# EAGLE design HM10 Breakout (EAGLE 9.6.2)
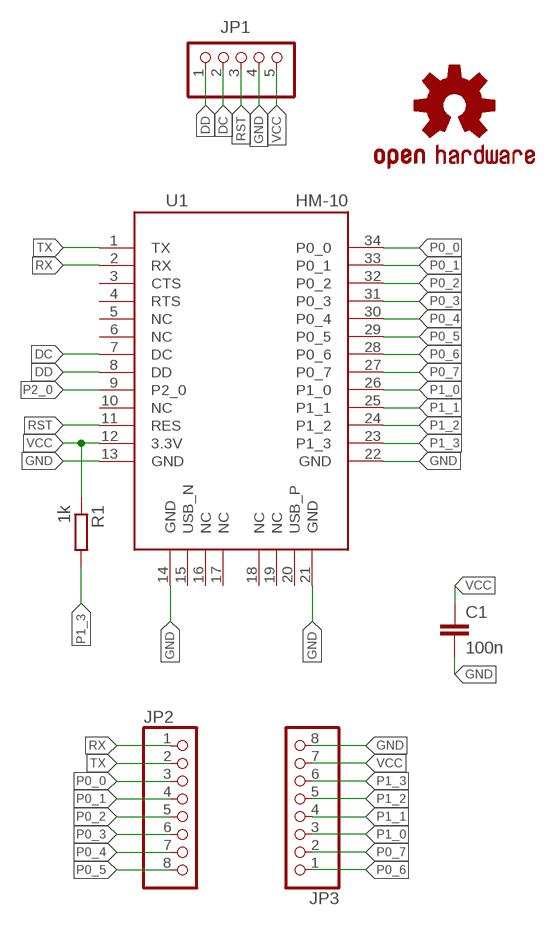
[diagram p0: schematic, sheet 1]

## Parts
C1  100n  C-EU1206  [1206]
JP1  PINHD-1X5  [1X05]
JP2  PINHD-1X8  [1X08]
JP3  PINHD-1X8  [1X08]
LOGO1  OSHW-LOGOM  [OSHW-LOGO-M]
R1  1k  R-EU_R1206  [R1206]
U1  HM-10  [HM-10]

## Nets
DC: JP1.2 U1.7(DC)
DD: JP1.1 U1.8(DD)
GND: C1.2 JP1.4 JP3.8 U1.13(GND) U1.14(GND) U1.21(GND) U1.22(GND)
P0_0: JP2.3 U1.34(P0_0)
P0_1: JP2.4 U1.33(P0_1)
P0_2: JP2.5 U1.32(P0_2)
P0_3: JP2.6 U1.31(P0_3)
P0_4: JP2.7 U1.30(P0_4)
P0_5: JP2.8 U1.29(P0_5)
P0_6: JP3.1 U1.28(P0_6)
P0_7: JP3.2 U1.27(P0_7)
P1_0: JP3.3 U1.26(P1_0)
P1_1: JP3.4 U1.25(P1_1)
P1_2: JP3.5 U1.24(P1_2)
P1_3: JP3.6 R1.2 U1.23(P1_3)
P2_0: U1.9(P2_0)
RST: JP1.3 U1.11(RES)
RX: JP2.1 U1.2(RX)
TX: JP2.2 U1.1(TX)
VCC: C1.1 JP1.5 JP3.7 R1.1 U1.12(3.3V)
Unconnected: U1.3(CTS) U1.4(RTS) U1.5(NC) U1.6(NC) U1.10(NC) U1.15(USB_N) U1.16(NC) U1.17(NC) U1.18(NC) U1.19(NC) U1.20(USB_P)

## Library data of the parts
C1 = Master 2016:C-EU: CAPACITOR, European symbol
JP1 = pinhead:PINHD-1X5: PIN HEADER
JP2 JP3 = pinhead:PINHD-1X8: PIN HEADER
LOGO1 = Master 2016:OSHW-LOGO: Open Source Hardware Logo This logo indicates the piece of hardware it is found on incorporates a OSHW license and/or adheres to the definition of open source hardware found here: http://freedomdefined.org/OSHW
R1 = rcl:R-EU_: RESISTOR, European symbol; SPICEPREFIX: R
U1 = SMD Stamp Modules:HM-10

## Board
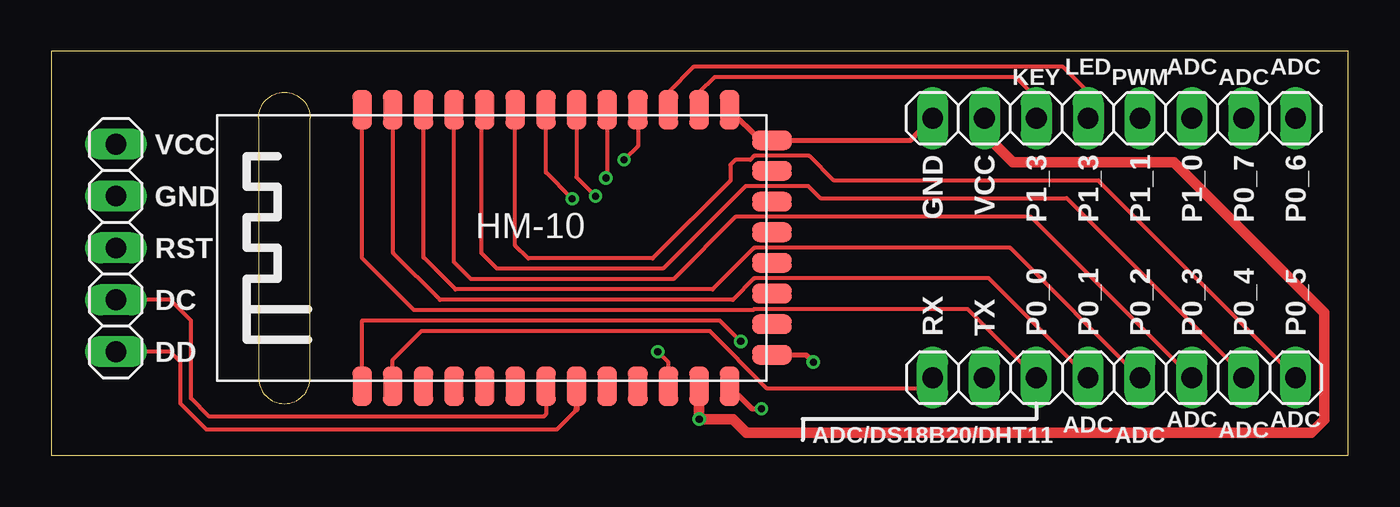
[diagram p1: board, top side]
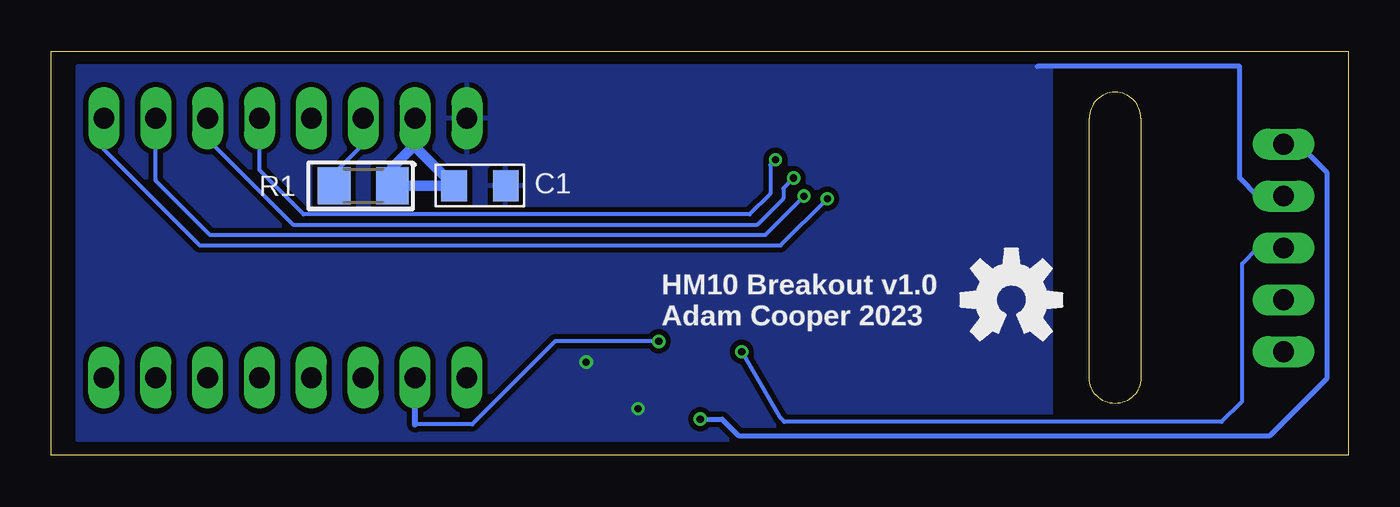
[diagram p2: board, bottom side, seen from below]

Size 63.55 x 19.8 mm. Coordinates in mm from the lower left corner, seen from the top.
Outline: 0,0 63.55,0 63.55,19.8 0,19.8 0,0
Copper layers (1*16): Top 0.035mm / dielectric 1.5mm / Bottom 0.035mm
Design rules "Seeed Fusion_eagle_rule_v1.1": minimum track width 6mil, minimum drill 12mil, track to track 6mil, track to pad 6mil, pad to pad 6mil, via to via 6mil, smd to smd 0mil, copper to edge 10mil, drill to drill 10mil, minimum pad ring 10mil, minimum via ring 6mil, stop-mask expansion 2mil, vias tented up to drill 100mil, thermal gap 10mil
Milling: 4 lines

### Footprints (pad centres in the part's own frame; a part is rotated, then mirrored left to right if it is on the bottom)
1206 = smd 1.27 x 1.524: 1 -1.27,0; 2 1.27,0
1X05 = drill 1.016 long: 1 -5.08,0; 2 -2.54,0; 3 0,0; 4 2.54,0; 5 5.08,0
1X08 = drill 1.016 long: 1 -8.89,0; 2 -6.35,0; 3 -3.81,0; 4 -1.27,0; 5 1.27,0; 6 3.81,0; 7 6.35,0; 8 8.89,0
R1206 = smd 1.6 x 1.803: 1 -1.422,0; 2 1.422,0
HM-10 = smd 1.93 x 0.965: 1 -6.77,6.35; 2 -6.77,4.85; 3 -6.77,3.35; 4 -6.77,1.85; 5 -6.77,0.35; 6 -6.77,-1.15; 7 -6.77,-2.65; 8 -6.77,-4.15; 9 -6.77,-5.65; 10 -6.77,-7.15; 11 -6.77,-8.65; 12 -6.77,-10.15; 13 -6.77,-11.65; 22 6.77,-11.65; 23 6.77,-10.15; 24 6.77,-8.65; 25 6.77,-7.15; 26 6.77,-5.65; 27 6.77,-4.15; 28 6.77,-2.65; 29 6.77,-1.15; 30 6.77,0.35; 31 6.77,1.85; 32 6.77,3.35; 33 6.77,4.85; 34 6.77,6.35 | smd 0.965 x 1.93: 14 -5.23,-13.72; 15 -3.73,-13.72; 16 -2.23,-13.72; 17 -0.73,-13.72; 18 0.77,-13.72; 19 2.27,-13.72; 20 3.77,-13.72; 21 5.27,-13.72

### Placement (x,y rotation side)
C1  42.55,13.21 0 bottom
JP1  3.17,10.16 90 top
JP2  52.07,3.81 0 top
JP3  52.07,16.51 180 top
LOGO1  16.51,7.62 0 bottom
R1  48.26,13.21 180 bottom
U1  21.59,10.16 90 top

### Tracks (layer width: path | path; a pad name or v marks a point on that pad's centre or on a via)
DC
  Top 0.203: U1.7 24.24,2.02 24.13,1.91 7.75,1.91 6.86,2.79 6.86,6.6 5.84,7.62 JP1.2
DD
  Top 0.203: JP1.1 5.84,5.08 6.35,4.57 6.35,2.54 7.62,1.27 24.77,1.27 25.74,2.25
  Top 0.305: U1.8 25.74,2.25
GND  (via drill 0.35 pad 0.61)
  Top 0.203: 34.74,15.43 U1.21
  Top 0.254: U1.13 34.34,2.29 v34.8,2.29 | U1.14 36.98,4.93 v37.34,4.57 | U1.21 42.1,15.43 JP3.8 | U1.22 34.74,15.43
  Bottom 0.152: JP1.4 4.45,12.7
  Bottom 0.254: 4.45,12.7 5.33,13.59 5.33,19.05 15.24,19.05
  pour Bottom (isolate 0.254): 14.61,19.05 14.61,0.76 62.23,0.76 62.23,19.05
P0_0
  Top 0.203: JP2.3 44.9,7.17 34.44,7.17 34.39,7.11 17.78,7.11 15.24,9.65 U1.34
P0_1
  Top 0.203: JP2.4 45.94,8.67 34.44,8.67 33.4,7.62 19.05,7.62 16.76,9.91 16.76,16.91 U1.33
P0_2
  Top 0.203: JP2.5 46.98,10.17 34.44,10.17 32.41,8.13 19.81,8.13 18.24,9.7 U1.32
P0_3
  Top 0.203: JP2.6 48.01,11.68 33.53,11.68 30.48,8.64 20.57,8.64 19.74,9.47 U1.31
P0_4
  Top 0.203: JP2.7 58.42,3.94 49.75,12.61 49.66,12.57 37.72,12.57 37.1,13.19 34.02,13.19 29.97,9.14 21.84,9.14 21.08,9.91 21.08,16.77 U1.30
P0_5
  Top 0.203: U1.29 22.74,10.28 23.37,9.65 29.46,9.65 33.27,13.46 33.27,14.22 33.53,14.48 34.26,14.48 34.44,14.67 37.15,14.67 38.35,13.46 51.31,13.46 JP2.8
P0_6  (via drill 0.35 pad 0.61)
  Top 0.203: v25.53,12.57 24.24,13.86 U1.28
  Bottom 0.203: JP3.1 60.96,14.99 56.26,10.29 27.81,10.29 v25.53,12.57
P0_7  (via drill 0.35 pad 0.61)
  Top 0.203: U1.27 25.74,13.63 v26.67,12.7
  Bottom 0.203: v26.67,12.7 28.57,10.79 55.75,10.79 58.42,13.46 JP3.2
P1_0  (via drill 0.35 pad 0.61)
  Top 0.203: U1.26 27.24,13.65 v27.18,13.59
  Bottom 0.203: JP3.3 55.88,15.49 51.69,11.3 28.96,11.3 27.69,12.57 27.69,13.08 v27.18,13.59
P1_1  (via drill 0.35 pad 0.61)
  Top 0.203: U1.25 28.74,15.15 v28.07,14.48
  Bottom 0.203: v28.07,14.48 28.32,14.22 28.32,12.83 29.34,11.81 51.18,11.81 53.34,13.97 JP3.4
P1_2
  Top 0.203: U1.24 30.24,17.79 31.5,19.05 49.53,19.05 50.8,17.78 JP3.5
P1_3
  Top 0.203: U1.23 31.75,17.78 32.51,18.54 47.24,18.54 48.26,17.53 JP3.6
  Bottom 0.203: JP3.6 48.26,15.24 49.68,13.82 R1.2
RST  (via drill 0.35 pad 0.61)
  Top 0.203: U1.11 30.24,4.56 v29.72,5.08
  Bottom 0.203: v29.72,5.08 27.85,1.87 27.63,1.65 6.22,1.65 5.21,2.67 5.21,9.4 4.45,10.16
  Bottom 0.305: 4.45,10.16 JP1.3
RX
  Top 0.203: U1.2 16.74,4.67 18.16,6.1 32.26,6.1 35.05,3.3 42.67,3.3
  Top 0.305: 42.67,3.3 JP2.1
TX  (via drill 0.35 pad 0.61)
  Top 0.203: U1.1 15.24,6.6 32.77,6.6 v33.78,5.59
  Bottom 0.203: v33.78,5.59 38.86,5.59 42.93,1.52 45.72,1.52
  Bottom 0.305: 45.72,1.52 JP2.2
VCC  (via drill 0.35 pad 0.61)
  Top 0.203: JP3.7 45.72,15.75
  Top 0.305: U1.12
  Top 0.508: U1.12 v31.75,1.78 33.4,1.78 34.06,1.12 61.72,1.12 62.36,1.75 62.36,6.99 54.99,14.35 47.12,14.35 45.72,15.75
  Bottom 0.254: v31.75,1.78 30.68,1.78 29.87,0.97 3.86,0.97 1.04,3.79 1.04,13.84 2.44,15.24
  Bottom 0.305: 2.44,15.24 JP1.5 | 45.72,15.11 JP3.7 45.72,15.21 | R1.1 46.84,14.1
  Bottom 0.508: 45.72,15.11 C1.1 R1.1 | 46.84,14.1 45.72,15.21

### Text on the board
tPlace: KEY | LED | PWM | ADC | ADC | ADC | VCC | GND | VCC | P1_3 | P1_3 | P1_1 | P1_0 | P0_7 | P0_6 | GND | RST | DC | RX | TX | P0_0 | P0_1 | P0_2 | P0_3 | P0_4 | P0_5 | DD | ADC | ADC | ADC | ADC/DS18B20/DHT11 | ADC | ADC
bNames: HM10 Breakout v1.0 / Adam Cooper 2023